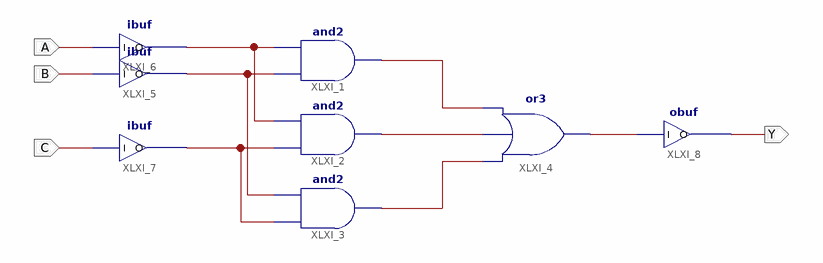
[diagram p0: schematic sheet 1]
// Xilinx ISE schematic Mayority_Detector.sch (spartan6) as structural Verilog: 8 symbols, 4 ports
module Mayority_Detector (
  input  A,
  input  B,
  input  C,
  output Y
);

  wire XLXN_1, XLXN_2, XLXN_6, XLXN_10, XLXN_11, XLXN_12, XLXN_13;

  and XLXI_1 (XLXN_2, XLXN_11, XLXN_10);
  and XLXI_2 (XLXN_1, XLXN_12, XLXN_10);
  and XLXI_3 (XLXN_6, XLXN_12, XLXN_11);
  or XLXI_4 (XLXN_13, XLXN_6, XLXN_1, XLXN_2);
  ibuf XLXI_5 (.I(B), .O(XLXN_11));
  ibuf XLXI_6 (.I(A), .O(XLXN_10));
  ibuf XLXI_7 (.I(C), .O(XLXN_12));
  obuf XLXI_8 (.I(XLXN_13), .O(Y));

  // Notes on the sheet:
  //   LOC on signal A = T10
  //   LOC on signal B = T9
  //   LOC on signal C = V9
  //   LOC on signal Y = U16
endmodule
